# Altium schematic sheet IMU_CON.SchDoc
size A4
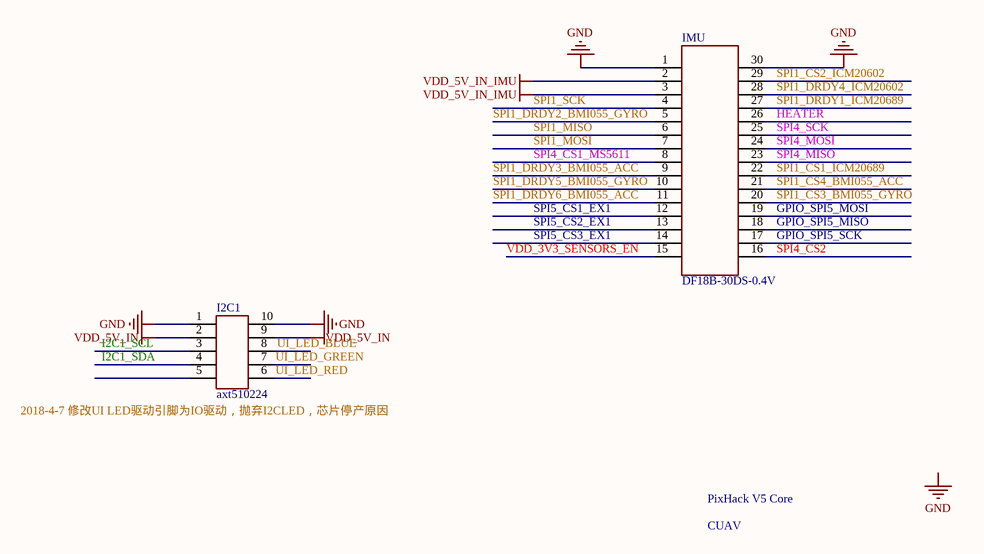
[diagram p0: IMU_CON.SchDoc]

## Parts
I2C1  axt510224  [axt510224]
IMU  DF18B-30DS-0.4V  [DF18B-30DS-0.4V]
PixHack_V5_Core  CUAV  [CUAV]

## Nets
GND: I2C1.1 I2C1.10 IMU.1 IMU.30
VDD_5V_IN: I2C1.2 I2C1.9
VDD_5V_IN_IMU: IMU.2 IMU.3
GPIO_SPI5_MISO: IMU.18
GPIO_SPI5_MOSI: IMU.19
GPIO_SPI5_SCK: IMU.17
HEATER: IMU.26
I2C1_SCL: I2C1.3
I2C1_SDA: I2C1.4
SPI1_CS1_ICM20689: IMU.22
SPI1_CS2_ICM20602: IMU.29
SPI1_CS3_BMI055_GYRO: IMU.20
SPI1_CS4_BMI055_ACC: IMU.21
SPI1_DRDY1_ICM20689: IMU.27
SPI1_DRDY2_BMI055_GYRO: IMU.5
SPI1_DRDY3_BMI055_ACC: IMU.9
SPI1_DRDY4_ICM20602: IMU.28
SPI1_DRDY5_BMI055_GYRO: IMU.10
SPI1_DRDY6_BMI055_ACC: IMU.11
SPI1_MISO: IMU.6
SPI1_MOSI: IMU.7
SPI1_SCK: IMU.4
SPI4_CS1_MS5611: IMU.8
SPI4_CS2: IMU.16
SPI4_MISO: IMU.23
SPI4_MOSI: IMU.24
SPI4_SCK: IMU.25
SPI5_CS1_EX1: IMU.12
SPI5_CS2_EX1: IMU.13
SPI5_CS3_EX1: IMU.14
UI_LED_BLUE: I2C1.8
UI_LED_GREEN: I2C1.7
UI_LED_RED: I2C1.6
VDD_3V3_SENSORS_EN: IMU.15

Not connected (* = marked no-connect by the designer): I2C1 5

## Notes on the sheet
- Labels drawn without touching a wire or pin: 2018-4-7 修改UI LED驱动引脚为IO驱动，抛弃I2CLED，芯片停产原因, GND